# Altium schematic sheet Sheet2.SchDoc: Smart IoT Wallswitch CORE module
size A4; DrawnBy: Bc. Miroslav Kažimír; DocumentNumber: Power and USB connection; SheetNumber: 3; SheetTotal: 3
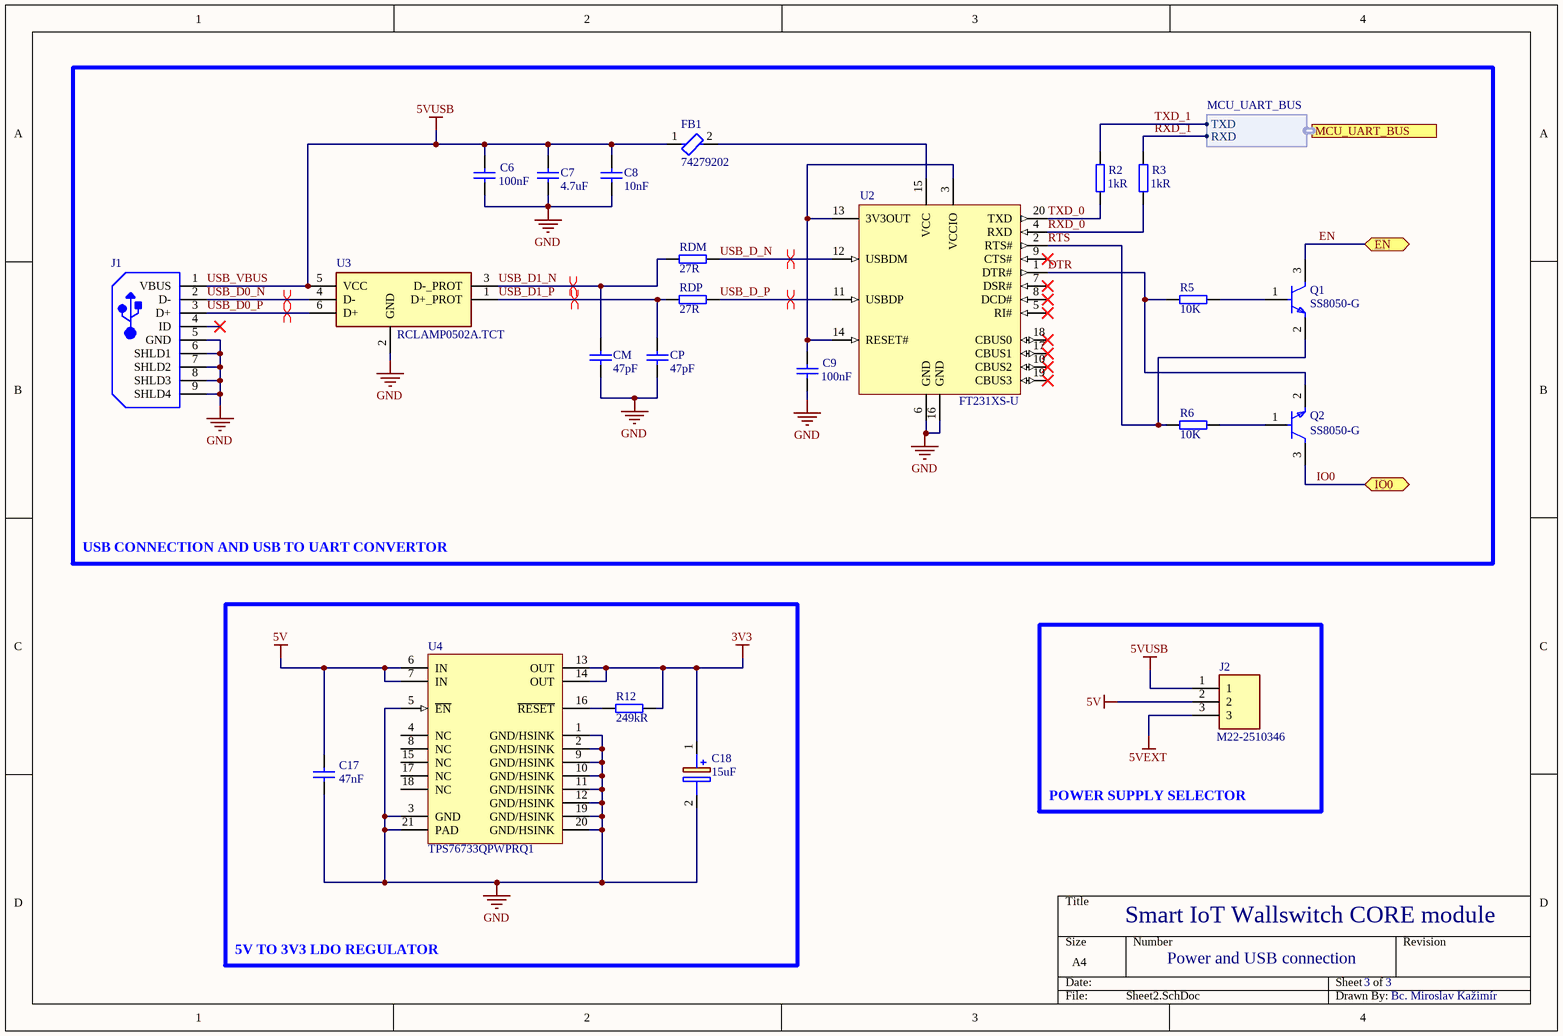
[diagram p0: Sheet2.SchDoc]

## Parts
C6  Capacitance: 100nF  [FP-C0805C-DN-IPC_A]  (hidden comment: C0805C104K5RAC7411)
C7  Capacitance: 4.7uF  [FP-GRM21B-0_15-IPC_A]  (hidden comment: GRM21BR71C475KE51L)
C8  Capacitance: 10nF  [FP-C0805C-DN-IPC_A]  (hidden comment: C0805C103J5RAC7025)
C9  Capacitance: 100nF  [FP-C0805C-DN-IPC_A]  (hidden comment: C0805C104K5RAC7411)
C17  Capacitance: 47nF  [FP-C0805C-DN-IPC_A]  (hidden comment: C0805C473K5RACAUTO)
C18  Capacitance: 15uF  [CAPPM3216X180N]  (hidden comment: T495A156K010ATE1K0)
CM  Capacitance: 47pF  [FP-C0805C-DN-IPC_A]  (hidden comment: C0805C470J5RACTU)
CP  Capacitance: 47pF  [FP-C0805C-DN-IPC_A]  (hidden comment: C0805C470J5RACTU)
FB1  74279202  [SMD-0805]
J1  10104110-0001LF  [101041100001LF]  (value not drawn)
J2  M22-2510346  [HDRV3W50P0X200_1X3_600X200X525P]
Q1  SS8050-G  [FP-SS8050-G-IPC_A]
Q2  SS8050-G  [FP-SS8050-G-IPC_A]
R2  Resistance: 1kR  [FP-ERJ3G-IPC_A]  (hidden comment: ERJ-3GEYJ102V)
R3  Resistance: 1kR  [FP-ERJ3G-IPC_A]  (hidden comment: ERJ-3GEYJ102V)
R5  Resistance: 10K  [RESC2012X70N]  (hidden comment: ERJ-UP6J103V)
R6  Resistance: 10K  [RESC2012X70N]  (hidden comment: ERJ-UP6J103V)
R12  Resistance: 249kR  [RESC2013X70X40NL20T20]  (hidden comment: ERJ-6ENF2493V)
RDM  Resistance: 27R  [RES_ERJP06F27R0V]  (hidden comment: ERJ-P06F27R0V)
RDP  Resistance: 27R  [RES_ERJP06F27R0V]  (hidden comment: ERJ-P06F27R0V)
U2  FT231XS-U  [SSOP-20_L]
U3  RCLAMP0502A.TCT  [SOTFL50P162X60-6N]
U4  TPS76733QPWPRQ1  [PWP0020L_L]

## Blocks framed on the sheet
USB CONNECTION AND USB TO UART CONVERTOR: C6-C9 CM CP FB1 J1 Q1 Q2 R2 R3 R5 R6 RDM RDP U2 U3
5V TO 3V3 LDO REGULATOR: C17 C18 R12 U4
POWER SUPPLY SELECTOR: J2

## Ports
EN (bidir), IO0 (bidir), MCU_UART_BUS (harness MCU_UART_BUS)

## Harnesses
MCU_UART_BUS: TXD, RXD

## Nets
3V3: C18.1(+) R12.1 U4.13(OUT) U4.14(OUT)
5V: C17.1 J2.2 U4.6(IN) U4.7(IN)
5VEXT: J2.3
GND: C6.2 C7.2 C8.2 C9.2 C17.2 C18.2(-) CM.2 CP.2 J1.5(GND) J1.6(SHLD1) J1.7(SHLD2) J1.8(SHLD3) J1.9(SHLD4) U2.6(GND) U2.16(GND) U3.2(GND) U4.1(GND/HSINK) U4.2(GND/HSINK) U4.3(GND) U4.5(~{EN}) U4.9(GND/HSINK) U4.10(GND/HSINK) U4.11(GND/HSINK) U4.12(GND/HSINK) U4.19(GND/HSINK) U4.20(GND/HSINK) U4.21(PAD)
USB_VBUS: C6.1 C7.1 C8.1 FB1.1 J1.1(VBUS) J2.1 U3.5(VCC)  [also labelled 5VUSB]
DTR: Q2.2(E) R5.1 U2.1(DTR#)
EN: Q1.3(C) ; port EN
IO0: Q2.3(C) ; port IO0
RTS: Q1.2(E) R6.1 U2.2(RTS#)
RXD_0: R3.2 U2.4(RXD)
RXD_1: R3.1 ; port MCU_UART_BUS.RXD
TXD_0: R2.2 U2.20(TXD)
TXD_1: R2.1 ; port MCU_UART_BUS.TXD
USB_D0_N: J1.2(D-) U3.4(D-)
USB_D0_P: J1.3(D+) U3.6(D+)
USB_D1_N: CM.1 RDM.1 U3.3(D-_PROT)
USB_D1_P: CP.1 RDP.1 U3.1(D+_PROT)
USB_D_N: RDM.2 U2.12(USBDM)
USB_D_P: RDP.2 U2.11(USBDP)
NetC9_1: C9.1 U2.3(VCCIO) U2.13(3V3OUT) U2.14(RESET#)
NetFB1_2: FB1.2 U2.15(VCC)
NetQ1_1: Q1.1(B) R5.2
NetQ2_1: Q2.1(B) R6.2
NetR12_2: R12.2 U4.16(~{RESET})

Not connected (* = marked no-connect by the designer): J1 4(ID)*; U2 5(RI#)* 7(DSR#)* 8(DCD#)* 9(CTS#)* 10(CBUS2)* 17(CBUS1)* 18(CBUS0)* 19(CBUS3)*; U4 4(NC) 8(NC) 15(NC) 17(NC) 18(NC)

## Layout directives
differential pair: USB_D0_N, USB_D0_P, USB_D1_N, USB_D1_P, USB_D_N, USB_D_P

## Library data of the parts
C6 C9 = C0805C104K5RAC7411: Cap Ceramic 0.1uF 50V X7R 10% SMD 0805 125°C Paper T/R; Manufacturer: KEMET; Supplier 1: Mouser; Manufacturer Part Number: C0805C104K5RAC7411; RoHS: Yes; Category: Ceramic Capacitors; Stock 1: 1484324; Pricing 1: 1=0,13000, 10=0,09300, 50=0,09300, 100=0,04400, 500=0,03100, 1000=0,02600, 2500=0,02400, 5000=0,02200, 10000=0,02100, 15000=0,02000 (USD); Mount: Surface Mount; Case/Package: 0805; Dielectric Material: Ceramic; Min Operating Temperature: -55°C; Max Operating Temperature: 125°C; Packaging: Tape and Reel; Tolerance: 10%; Dielectric: X7R; Voltage Rating (DC): 50V; Construction: Flat; Length: 2mm; Height: 0.9mm; Depth: 1.25mm; Radiation Hardening: No; RoHS Compliant: Yes; ComponentLink1URL: http://components.arrow.com/part/dataview/30748302S8994022N7429?src-supplier=Arrow+Electronics; ComponentLink1Description: http://components.arrow.com/part/dataview/30748302S8994022N7429?src-supplier=Arrow+Electronics; ComponentLink2URL: https://www.verical.com/server-webapp/html/getDatasheet?partID=248513&src-supplier=Verical; ComponentLink2Description: https://www.verical.com/server-webapp/html/getDatasheet?partID=248513&src-supplier=Verical; Supplier Part Number 1: 80-C0805C104K5RACLR
C7 = GRM21BR71C475KE51L: Cap Ceramic 4.7uF 16V X7R 10% SMD 0805 125°C Embossed Plastic T/R; Manufacturer: Murata; Supplier 1: Mouser; Manufacturer Part Number: GRM21BR71C475KE51L; RoHS: Yes; Category: Ceramic Capacitors; Stock 1: 388295; Pricing 1: 1=0,19000, 10=0,13400, 50=0,13400, 100=0,06400, 500=0,04500, 1000=0,03700, 3000=0,03500, 6000=0,03300, 10000=0,03300 (USD); Case/Package: 0805; Tolerance: 10%; Dielectric: X7R; Voltage Rating (DC): 16V; Length: 2mm; Width: 1.25mm; Thickness: 1.25mm; RoHS Compliant: Yes; ComponentLink1URL: http://www.farnell.com/datasheets/2189142.pdf?src-supplier=Farnell; ComponentLink1Description: http://www.farnell.com/datasheets/2189142.pdf?src-supplier=Farnell; ComponentLink2URL: http://search.murata.co.jp/Ceramy/image/img/A01X/G101/ENG/GRM21BR71C475KE51-01.pdf?src-supplier=Digi-Key; ComponentLink2Description: http://search.murata.co.jp/Ceramy/image/img/A01X/G101/ENG/GRM21BR71C475KE51-01.pdf?src-supplier=Digi-Key; Supplier Part Number 1: 81-GRM21BR71C475KE1L
C8 = C0805C103J5RAC7025: Cap Ceramic 0.01uF 50V X7R 5% SMD 0805 125°C Paper T/R; Manufacturer: KEMET; Supplier 1: Mouser; Manufacturer Part Number: C0805C103J5RAC7025; RoHS: Yes; Category: Ceramic Capacitors; Stock 1: 20879; Pricing 1: 1=0,12000, 10=0,07600, 50=0,07600, 100=0,03600, 1000=0,02300, 10000=0,01800 (USD); Mount: Surface Mount; Case/Package: 0805; Case Code (Imperial): 0805; Case Code (Metric): 2012; Dielectric Material: Ceramic; Min Operating Temperature: -55°C; Max Operating Temperature: 125°C; Tolerance: 5%; Dielectric: X7R; Packaging: Tape and Reel; Package Quantity: 4000; Voltage Rating: 50V; Voltage Rating (DC): 50V; Termination: SMD/SMT; Series: C0805C; Construction: Flat; Length: 2mm; Height: 0.78mm; Depth: 1.25mm; Lead Pitch: 0.75mm; Radiation Hardening: No; RoHS Compliant: Yes; ComponentLink1URL: http://www.mouser.com/ds/2/212/KEM_C1002_X7R_SMD-1102033.pdf?src-supplier=Mouser; ComponentLink1Description: http://www.mouser.com/ds/2/212/KEM_C1002_X7R_SMD-1102033.pdf?src-supplier=Mouser; Supplier Part Number 1: 80-C0805C103J5RACTM
C17 = C0805C473K5RACAUTO: KEMET   C0805C473K5RACAUTO   Multilayer Ceramic Capacitor, AEC-Q200 MLCC Series, 0.047 F,  10%, X7R, 50 V; Voltage Rating: 50V; Supplier 1: Mouser; Manufacturer: KEMET; Manufacturer Part Number: C0805C473K5RACAUTO; RoHS: Yes; Category: Ceramic Capacitors; Stock 1: 55914; Pricing 1: 1=0,19000, 10=0,07900, 50=0,07900, 100=0,06700, 500=0,04600, 1000=0,04100, 4000=0,03800, 8000=0,03700, 10000=0,03700, 12000=0,03600, 24000=0,03500 (USD); Mount: Surface Mount; Case/Package: 0805; Case Code (Metric): 2012; Case Code (Imperial): 0805; Contact Plating: Tin,Matte; Dielectric Material: Ceramic; Min Operating Temperature: -55°C; Max Operating Temperature: 125°C; Tolerance: 10%; Dielectric: X7R; Package Quantity: 1; Packaging: Tape and Reel; Voltage Rating (DC): 50V; Termination: SMD/SMT; Series: C; Construction: Flat; Length: 2mm; Width: 0.049inch; Height: 0.78mm; Depth: 1.25mm; Thickness: 0.035inch; Ratings: AEC-Q200; Radiation Hardening: No; REACH SVHC: No SVHC; RoHS Compliant: Yes; ComponentLink1URL: https://datasheet.ciiva.com/7842/1633156-7842358.pdf?src-supplier=Element14; ComponentLink1Description: https://datasheet.ciiva.com/7842/1633156-7842358.pdf?src-supplier=Element14; ComponentLink2URL: https://datasheet.ciiva.com/22704/1633156-22704879.pdf?src-supplier=Element14; ComponentLink2Description: https://datasheet.ciiva.com/22704/1633156-22704879.pdf?src-supplier=Element14; Supplier Part Number 1: 80-C0805C473K5RAUTO
C18 = T495A156K010ATE1K0: Cap Tant Solid 15uF 10V A CASE 10% (3.2 X 1.6 X 1.6mm) Inward L SMD 3216-18 1 Ohm 125C Automotive T/R; Manufacturer: KEMET; ESR (Equivalent Series Resistance): 1R; Life (Hours): 2000Hour; Supplier 1: Mouser; Manufacturer Part Number: T495A156K010ATE1K0; RoHS: Yes; Category: Tantalum Capacitors; Stock 1: 278; Pricing 1: 1=0,73000, 10=0,59100, 50=0,44700, 100=0,38900, 1000=0,30900, 10000=0,28100 (USD); Mount: Surface Mount; Case/Package: 1206; Case Code (Metric): 3216; Case Code (Imperial): 1206; Min Operating Temperature: -55°C; Max Operating Temperature: 125°C; Package Quantity: 2000; Packaging: Tape and Reel; Tolerance: 10%; Voltage Rating: 10V; Features: General Purpose; Length: 0.126inch; Width: 0.063inch; Height - Seated (Max): 0.071inch; RoHS Compliant: Yes; ComponentLink1URL: http://www.kemet.com/docfinder?Partnumber=T495A156K010ATE1K0&src-supplier=Digi-Key; ComponentLink1Description: http://www.kemet.com/docfinder?Partnumber=T495A156K010ATE1K0&src-supplier=Digi-Key; ComponentLink2URL: https://api.kemet.com/component-edge/download/datasheet/T495A156K010ATE1K0.pdf?src-supplier=Digi-Key; ComponentLink2Description: https://api.kemet.com/component-edge/download/datasheet/T495A156K010ATE1K0.pdf?src-supplier=Digi-Key; Supplier Part Number 1: 80-T495A156K10ATE1K0
CM CP = C0805C470J5RACTU: 47.0Pf 50.0V Rohs Compliant: Yes; Manufacturer: KEMET; Supplier 1: Mouser; Manufacturer Part Number: C0805C470J5RACTU; RoHS: Yes; Category: Ceramic Capacitors; Stock 1: 9354; Pricing 1: 1=0,28000, 10=0,19800, 50=0,19800, 100=0,11200, 1000=0,06900, 10000=0,06000 (USD); RoHS Compliant: Yes; Supplier Part Number 1: 80-C0805C470J5RACTU
FB1 = 74279202: Ferrite SMD Construction form: 0805 DC resistance: 0.1 Ohm Impedance @ 100 MHz: 120 Ohm; Manufacturer: Wurth Electronics; Tolerance: 25%; Impedance: 120R; Max Current Rating: 500mA; DC Resistance (DCR): 100mR; Test Frequency: 100MHz; Number of Lines: 1; Supplier 1: Mouser; Manufacturer Part Number: 74279202; RoHS: Yes; Category: Ferrite Beads and Chips; Mount: Surface Mount; Case/Package: SMD/SMT; Case Code (Metric): 2012; Case Code (Imperial): 0805; Weight: 0.000388oz; Min Operating Temperature: -55°C; Max Operating Temperature: 125°C; Package Quantity: 1; Packaging: Tape and Reel; Max DC Current: 500mA; Termination: SMD/SMT; Series: WE-CBF; Current Rating: 500mA; Resistance: 100mR; Length: 2mm; Width: 1.2mm; Height: 0.9mm; Depth: 1.24mm; REACH SVHC: Unknown; RoHS Compliant: Yes; Lead Free: Lead Free; ComponentLink1URL: https://datasheet.ciiva.com/1126/1696029-1126528.pdf?src-supplier=Element14; ComponentLink1Description: https://datasheet.ciiva.com/1126/1696029-1126528.pdf?src-supplier=Element14; ComponentLink2URL: https://datasheet.ciiva.com/11795/0900766b80bbd134-11795958.pdf?src-supplier=RSComponents; ComponentLink2Description: https://datasheet.ciiva.com/11795/0900766b80bbd134-11795958.pdf?src-supplier=RSComponents; ComponentLink3URL: https://datasheet.ciiva.com/4940/74279202-50314-4940485.pdf?src-supplier=Mouser; ComponentLink3Description: https://datasheet.ciiva.com/4940/74279202-50314-4940485.pdf?src-supplier=Mouser; ComponentLink4URL: https://datasheet.ciiva.com/6212/74279202-6212647.pdf?src-supplier=Digi-Key; ComponentLink4Description: https://datasheet.ciiva.com/6212/74279202-6212647.pdf?src-supplier=Digi-Key; ComponentLink5URL: https://datasheet.ciiva.com/22711/1696029-22711339.pdf?src-supplier=Element14; ComponentLink5Description: https://datasheet.ciiva.com/22711/1696029-22711339.pdf?src-supplier=Element14; ComponentLink6URL: https://datasheet.ciiva.com/6212/74279202-6212651.pdf?src-supplier=Digi-Key; ComponentLink6Description: https://datasheet.ciiva.com/6212/74279202-6212651.pdf?src-supplier=Digi-Key; ComponentLink7URL: https://datasheet.ciiva.com/6212/74279202-6212654.pdf?src-supplier=Digi-Key; ComponentLink7Description: https://datasheet.ciiva.com/6212/74279202-6212654.pdf?src-supplier=Digi-Key; Supplier Part Number 1: 710-74279202
J1 = 10104110-0001LF: Conn Micro USB 2.0 Type B RCP 5 POS 0.65mm Solder RA SMD 5 Terminal 1 Port T/R; Manufacturer: Amphenol ICC / FCI; Supplier 1: Mouser; Manufacturer Part Number: 10104110-0001LF; RoHS: No; Category: USB Connectors; Stock 1: 23329; Pricing 1: 1=0,83000, 10=0,65600, 50=0,65600, 100=0,57100, 1000=0,45600, 10000=0,40800 (USD); ComponentLink1URL: https://datasheet.ciiva.com/11731/0900766b80ed1ae6-11731334.pdf?src-supplier=RSComponents; ComponentLink1Description: https://datasheet.ciiva.com/11731/0900766b80ed1ae6-11731334.pdf?src-supplier=RSComponents; ComponentLink2URL: https://datasheet.ciiva.com/5726/10104110-5726973.pdf?src-supplier=Farnell; ComponentLink2Description: https://datasheet.ciiva.com/5726/10104110-5726973.pdf?src-supplier=Farnell; Supplier Part Number 1: 649-10104110-0001LF
J2 = M22-2510346: 2.00mm (0.079") Pitch SIL Vertical 2.4mm PC Tail Pin Header, 3.5mm mating pin height, tin, 3 contacts; Manufacturer: Harwin; Number of Contacts: 3; Max Current Rating: 1A; Contact Resistance: 30mR; Voltage Rating: 650V; Gender: Male; Connector Type: Male Pin; Pitch: 2mm; Supplier 1: Mouser; Manufacturer Part Number: M22-2510346; RoHS: Yes; Category: Headers and Wire Housings; Stock 1: 3158; Pricing 1: 1=0,24000, 10=0,18300, 50=0,18300, 100=0,14900, 1000=0,10900, 10000=0,08800 (USD); Mount: Through Hole; Case/Package: SIL; Contact Plating: Tin; Contact Material: Bronze; Color: Black; Housing Color: Black; Housing Material: Nylon; Min Operating Temperature: -55°C; Max Operating Temperature: 105°C; Number of Rows: 1; Termination: Solder; Current Rating: 1A; Package Quantity: 1000; Packaging: Bulk; Number of Positions: 3; Orientation: Straight; Series: M22; Contact Type: Male Pin; Length: 6mm; Contact Mating Length: 0.138inch; Depth: 2mm; RoHS Compliant: Yes; ComponentLink1URL: http://www.mouser.com/ds/2/181/M22-251-1134335.pdf?src-supplier=Mouser; ComponentLink1Description: http://www.mouser.com/ds/2/181/M22-251-1134335.pdf?src-supplier=Mouser; ComponentLink2URL: http://cdn.harwin.com/pdfs/M22-251.pdf?src-supplier=Digi-Key; ComponentLink2Description: http://cdn.harwin.com/pdfs/M22-251.pdf?src-supplier=Digi-Key; ComponentLink3URL: http://www.harwin.com/include/downloads/pdfs/2010PAGE109.PDF?src-supplier=Avnet; ComponentLink3Description: http://www.harwin.com/include/downloads/pdfs/2010PAGE109.PDF?src-supplier=Avnet; ComponentLink4URL: https://cdn.harwin.com/pdfs/M22-251.pdf?src-supplier=Digi-Key; ComponentLink4Description: https://cdn.harwin.com/pdfs/M22-251.pdf?src-supplier=Digi-Key; Supplier Part Number 1: 855-M22-2510346
Q1 Q2 = SS8050-G: Trans Gp Bjt NPN 25V 1.5A 300MW 3-PIN SOT-23 T/r; Manufacturer: Comchip; Collector Emitter Voltage (VCEO): 400mV; Transition Frequency: 100MHz; Supplier 1: Mouser; Manufacturer Part Number: SS8050-G; RoHS: Yes; Stock 1: 22728; Pricing 1: 1=0,31000, 10=0,20400, 50=0,20400, 100=0,09200, 1000=0,05800, 3000=0,04400, 9000=0,03700, 10000=0,03700, 24000=0,03500, 45000=0,03300, 99000=0,02800 (USD); Mount: Surface Mount; Case/Package: TO-236-3; Packaging: Tape and Reel; Max Collector Current: 1.5A; Max Power Dissipation: 300mW; Collector Emitter Breakdown Voltage: 25V; Max Breakdown Voltage: 25V; ComponentLink1URL: http://www.comchiptech.com/admin/files/product/SS8050-G RevA181526.pdf?src-supplier=Digi-Key; ComponentLink1Description: http://www.comchiptech.com/admin/files/product/SS8050-G RevA181526.pdf?src-supplier=Digi-Key; ComponentLink2URL: http://www.comchiptech.com/cms/UserFiles/SS8050-G%20RevA181526.pdf?src-supplier=Digi-Key; ComponentLink2Description: http://www.comchiptech.com/cms/UserFiles/SS8050-G%20RevA181526.pdf?src-supplier=Digi-Key; Supplier Part Number 1: 750-SS8050-G
R2 R3 = ERJ-3GEYJ102V: RES SMD 1K OHM 5% 1/10W 0603; Manufacturer: Panasonic; Temperature Coefficient: 200ppm/°C; Power Rating: 100mW; Voltage Rating: 75V; Voltage Rating (DC): 50V; Supplier 1: Mouser; Manufacturer Part Number: ERJ-3GEYJ102V; RoHS: Yes; Category: Chip SMD Resistors; Stock 1: 2053319; Pricing 1: 1=0,10000, 10=0,04400, 50=0,04400, 100=0,01800, 1000=0,00800, 2500=0,00700, 5000=0,00500, 10000=0,00500 (USD); Mount: Surface Mount; Case/Package: 0603; Weight: 7.1E-05oz; Contact Plating: Tin; Case Code (Metric): 1608; Case Code (Imperial): 0603; Min Operating Temperature: -55°C; Max Operating Temperature: 155°C; Tolerance: 5%; Resistor Type: Thick Film; Packaging: Tape and Reel; Package Quantity: 1; Termination: SMD/SMT; Max Power Dissipation: 100mW; Number of Terminations: 2; Working Voltage: 75V; Features: Automotive AEC-Q200; Series: ERJ; Technology: THICK FILM; Construction: Rectangular; Resistance Tolerance: 5%; Length: 1.6mm; Width: 0.031inch; Height: 0.45mm; Depth: 0.8mm; Radiation Hardening: No; REACH SVHC: No SVHC; Military Standard: Not; Lead Free: Lead Free; RoHS Compliant: Yes; ComponentLink1URL: https://datasheet.ciiva.com/34303/1988487-34303608.pdf?src-supplier=Jameco; ComponentLink1Description: https://datasheet.ciiva.com/34303/1988487-34303608.pdf?src-supplier=Jameco; ComponentLink2URL: https://datasheet.ciiva.com/11808/0900766b80f806dd-11808320.pdf?src-supplier=RSComponents; ComponentLink2Description: https://datasheet.ciiva.com/11808/0900766b80f806dd-11808320.pdf?src-supplier=RSComponents; ComponentLink3URL: https://datasheet.ciiva.com/43460/1678796-43460714.pdf?src-supplier=Farnell; ComponentLink3Description: https://datasheet.ciiva.com/43460/1678796-43460714.pdf?src-supplier=Farnell; ComponentLink4URL: https://datasheet.ciiva.com/46386/1678796-46386459.pdf?src-supplier=Element14; ComponentLink4Description: https://datasheet.ciiva.com/46386/1678796-46386459.pdf?src-supplier=Element14; ComponentLink5URL: https://datasheet.ciiva.com/22783/1678796-22783822.pdf?src-supplier=Farnell; ComponentLink5Description: https://datasheet.ciiva.com/22783/1678796-22783822.pdf?src-supplier=Farnell; ComponentLink6URL: https://datasheet.ciiva.com/46371/1678796-46371934.pdf?src-supplier=Element14; ComponentLink6Description: https://datasheet.ciiva.com/46371/1678796-46371934.pdf?src-supplier=Element14; ComponentLink7URL: https://datasheet.ciiva.com/28532/1678796-28532126.pdf?src-supplier=Element14; ComponentLink7Description: https://datasheet.ciiva.com/28532/1678796-28532126.pdf?src-supplier=Element14; ComponentLink8URL: https://datasheet.ciiva.com/46451/1678796-46451226.pdf?src-supplier=Element14; ComponentLink8Description: https://datasheet.ciiva.com/46451/1678796-46451226.pdf?src-supplier=Element14; ComponentLink9URL: https://datasheet.ciiva.com/24159/aoa0000ce1-37422-24159481.pdf?src-supplier=Mouser; ComponentLink9Description: https://datasheet.ciiva.com/24159/aoa0000ce1-37422-24159481.pdf?src-supplier=Mouser; ComponentLink10URL: https://datasheet.ciiva.com/16787/70255313-16787626.pdf?src-supplier=Allied+Electronics; ComponentLink10Description: https://datasheet.ciiva.com/16787/70255313-16787626.pdf?src-supplier=Allied+Electronics; ComponentLink11URL: https://datasheet.ciiva.com/9117/aoa0000ce1-9117035.pdf?src-supplier=Avnet; ComponentLink11Description: https://datasheet.ciiva.com/9117/aoa0000ce1-9117035.pdf?src-supplier=Avnet; ComponentLink12URL: https://datasheet.ciiva.com/16740/aoa0000ce1-16740759.pdf?src-supplier=Future+Electronics; ComponentLink12Description: https://datasheet.ciiva.com/16740/aoa0000ce1-16740759.pdf?src-supplier=Future+Electronics; ComponentLink13URL: https://datasheet.ciiva.com/48532/aoa0000ce1-48532155.pdf?src-supplier=Avnet; ComponentLink13Description: https://datasheet.ciiva.com/48532/aoa0000ce1-48532155.pdf?src-supplier=Avnet; ComponentLink14URL: https://datasheet.ciiva.com/30224/4aoa0000ce1-30224167.pdf?src-supplier=Onlinecomponents.com; ComponentLink14Description: https://datasheet.ciiva.com/30224/4aoa0000ce1-30224167.pdf?src-supplier=Onlinecomponents.com; Supplier Part Number 1: 667-ERJ-3GEYJ102V
R5 R6 = ERJ-UP6J103V: Res 10K Ohm 5% 1/2W 0805; Manufacturer: Panasonic; Supplier 1: Mouser; Manufacturer Part Number: ERJ-UP6J103V; RoHS: No; Category: Chip SMD Resistors; Stock 1: 46150; Pricing 1: 1=0,16000, 10=0,11900, 50=0,11900, 100=0,05800, 1000=0,02500, 10000=0,02100 (USD); Supplier Part Number 1: 667-ERJ-UP6J103V
R12 = ERJ-6ENF2493V: Res Thick Film 0805 249K Ohm 1% 1/8W ±100ppm/°C Molded SMD Punched Carrier T/R; Manufacturer: Panasonic; Voltage Rating: 150V; Power Rating: 125mW; Supplier 1: Mouser; Manufacturer Part Number: ERJ-6ENF2493V; RoHS: Yes; Category: Chip SMD Resistors; Stock 1: 22124; Pricing 1: 1=0,11000, 10=0,08300, 50=0,08300, 100=0,03200, 1000=0,01400, 10000=0,01000 (USD); Mount: Surface Mount; Case/Package: 0805; Contact Plating: Tin; Case Code (Imperial): 0805; Case Code (Metric): 2012; Min Operating Temperature: -55°C; Max Operating Temperature: 155°C; Tolerance: 1%; Resistor Type: Thick Film; Temperature Coefficient: 100ppm/°C; Packaging: Tape and Reel; Package Quantity: 5000; Number of Terminations: 2; Termination: SMD/SMT; Max Power Dissipation: 125mW; Voltage Rating (DC): 150V; Series: ERJ; Resistance Tolerance: 1%; Construction: Rectangular; Technology: THICK FILM; Length: 2mm; Width: 1.2mm; Height: 0.6mm; Depth: 1.25mm; Radiation Hardening: No; REACH SVHC: Unknown; Military Standard: Not; Lead Free: Lead Free; RoHS Compliant: Yes; ComponentLink1URL: https://datasheet.ciiva.com/11821/0900766b80f80784-11821592.pdf?src-supplier=RSComponents; ComponentLink1Description: https://datasheet.ciiva.com/11821/0900766b80f80784-11821592.pdf?src-supplier=RSComponents; ComponentLink2URL: https://datasheet.ciiva.com/16770/70260748-16770245.pdf?src-supplier=Allied+Electronics; ComponentLink2Description: https://datasheet.ciiva.com/16770/70260748-16770245.pdf?src-supplier=Allied+Electronics; ComponentLink3URL: https://datasheet.ciiva.com/30160/aoa0000ce2-30160949.pdf?src-supplier=Onlinecomponents.com; ComponentLink3Description: https://datasheet.ciiva.com/30160/aoa0000ce2-30160949.pdf?src-supplier=Onlinecomponents.com; ComponentLink4URL: https://datasheet.ciiva.com/43460/426256-43460070.pdf?src-supplier=Farnell; ComponentLink4Description: https://datasheet.ciiva.com/43460/426256-43460070.pdf?src-supplier=Farnell; ComponentLink5URL: https://datasheet.ciiva.com/9183/aoa0000ce2-9183882.pdf?src-supplier=Avnet; ComponentLink5Description: https://datasheet.ciiva.com/9183/aoa0000ce2-9183882.pdf?src-supplier=Avnet; ComponentLink6URL: https://datasheet.ciiva.com/46377/426256-46377786.pdf?src-supplier=Element14; ComponentLink6Description: https://datasheet.ciiva.com/46377/426256-46377786.pdf?src-supplier=Element14; ComponentLink7URL: https://datasheet.ciiva.com/28692/1678782-28692523.pdf?src-supplier=Element14; ComponentLink7Description: https://datasheet.ciiva.com/28692/1678782-28692523.pdf?src-supplier=Element14; ComponentLink8URL: https://datasheet.ciiva.com/28594/1678782-28594733.pdf?src-supplier=Element14; ComponentLink8Description: https://datasheet.ciiva.com/28594/1678782-28594733.pdf?src-supplier=Element14; ComponentLink9URL: https://datasheet.ciiva.com/29927/aoa0000ce2-29927535.pdf?src-supplier=Avnet; ComponentLink9Description: https://datasheet.ciiva.com/29927/aoa0000ce2-29927535.pdf?src-supplier=Avnet; Supplier Part Number 1: 667-ERJ-6ENF2493V
RDM RDP = ERJ-P06F27R0V: Res Thick Film 0805 27 Ohm 1% 0.25W ±300ppm/°C Molded SMD Punched Carrier T/R; Manufacturer: Panasonic; Power Rating: 500mW; Voltage Rating: 150V; Supplier 1: Mouser; Manufacturer Part Number: ERJ-P06F27R0V; RoHS: Yes; Category: Chip SMD Resistors; Stock 1: 25086; Pricing 1: 1=0,20000, 10=0,16900, 50=0,16900, 100=0,06700, 1000=0,02800, 10000=0,02300 (USD); Mount: Surface Mount; Case/Package: 0805; Number of Pins: 2; Contact Plating: Tin; Case Code (Imperial): 0805; Case Code (Metric): 2012; Weight: 0.000194oz; Min Operating Temperature: -55°C; Max Operating Temperature: 155°C; Tolerance: 1%; Resistor Type: Thick Film; Temperature Coefficient: 300ppm/°C; Packaging: Tape and Reel; Termination: SMD/SMT; Voltage Rating (DC): 150V; Length: 2mm; Width: 1.2mm; Height: 0.6mm; Depth: 1.25mm; Radiation Hardening: No; REACH SVHC: No SVHC; Military Standard: Not; RoHS Compliant: Yes; ComponentLink1URL: https://datasheet.ciiva.com/11810/0900766b812cb812-11810836.pdf?src-supplier=RSComponents; ComponentLink1Description: https://datasheet.ciiva.com/11810/0900766b812cb812-11810836.pdf?src-supplier=RSComponents; ComponentLink2URL: https://datasheet.ciiva.com/48426/erjp-series-eng-tds-48426807.pdf?src-supplier=Distrelec; ComponentLink2Description: https://datasheet.ciiva.com/48426/erjp-series-eng-tds-48426807.pdf?src-supplier=Distrelec; ComponentLink3URL: https://datasheet.ciiva.com/5915/1801181-5915438.pdf?src-supplier=Farnell; ComponentLink3Description: https://datasheet.ciiva.com/5915/1801181-5915438.pdf?src-supplier=Farnell; ComponentLink4URL: https://datasheet.ciiva.com/7891/1801181-7891423.pdf?src-supplier=Element14; ComponentLink4Description: https://datasheet.ciiva.com/7891/1801181-7891423.pdf?src-supplier=Element14; ComponentLink5URL: https://datasheet.ciiva.com/5915/1801181-5915437.pdf?src-supplier=Farnell; ComponentLink5Description: https://datasheet.ciiva.com/5915/1801181-5915437.pdf?src-supplier=Farnell; ComponentLink6URL: https://datasheet.ciiva.com/24125/aoa0000ce4-64075-24125050.pdf?src-supplier=Mouser; ComponentLink6Description: https://datasheet.ciiva.com/24125/aoa0000ce4-64075-24125050.pdf?src-supplier=Mouser; ComponentLink7URL: https://datasheet.ciiva.com/9297/aoa0000ce4-9297918.pdf?src-supplier=Avnet; ComponentLink7Description: https://datasheet.ciiva.com/9297/aoa0000ce4-9297918.pdf?src-supplier=Avnet; Supplier Part Number 1: 667-ERJ-P06F27R0V
U2 = FT231XS-U: FT231XS-U, Usb Controller, 3MBD, Usb 1.1, Usb 2.0, 5 V, 20-PIN SSOP; Manufacturer: FTDI; Number of Channels: 1; Operating Supply Voltage: 5V; Max Supply Voltage: 5.5V; Min Supply Voltage: 2.97V; Data Rate: 3Mbps; ESD Protection: Yes; Supplier 1: Mouser; Manufacturer Part Number: FT231XS-U; RoHS: Yes; Category: Interface ICs; Stock 1: 294; Pricing 1: 1=2,34000, 10=2,34000, 25=2,27000, 50=2,27000, 100=2,27000, 116=2,20000, 1000=1,82000, 10000=1,75000 (USD); Mount: Surface Mount; Case/Package: SSOP; Number of Pins: 20; Min Operating Temperature: -40°C; Max Operating Temperature: 85°C; Packaging: Rail/Tube; Package Quantity: 58; Number of Transceivers: 1; Series: *; Length: 8.74mm; Width: 3.99mm; Height: 1.5mm; Radiation Hardening: No; Lead Free: Lead Free; RoHS Compliant: Yes; ComponentLink1URL: https://datasheet.ciiva.com/48909/70403933-48909079.pdf?src-supplier=Allied+Electronics; ComponentLink1Description: https://datasheet.ciiva.com/48909/70403933-48909079.pdf?src-supplier=Allied+Electronics; ComponentLink2URL: https://datasheet.ciiva.com/15150/getdatasheetpartid-643513-15150507.pdf?src-supplier=Verical; ComponentLink2Description: https://datasheet.ciiva.com/15150/getdatasheetpartid-643513-15150507.pdf?src-supplier=Verical; ComponentLink3URL: https://datasheet.ciiva.com/16379/ds-ft231x-16379279.pdf?src-supplier=Future+Electronics; ComponentLink3Description: https://datasheet.ciiva.com/16379/ds-ft231x-16379279.pdf?src-supplier=Future+Electronics; Supplier Part Number 1: 895-FT231XS-U
U3 = RCLAMP0502A.TCT: TVS二极管 5V IPPM=3A 50W 单向; Manufacturer: Semtech; Direction: Unidirectional; Capacitance: 0.9pF; Number of Channels: 2; Reverse Breakdown Voltage: 6V; Number of Elements: 1; Clamping Voltage: 18V; Power Line Protection: Yes; Peak Pulse Current: 3A; Test Current: 1mA; Max Reverse Leakage Current: 1uA; Element Configuration: Single; Supplier 1: Mouser; Manufacturer Part Number: RCLAMP0502A.TCT; RoHS: Yes; Category: TVS Diodes; Stock 1: 213169; Pricing 1: 1=0,91000, 10=0,79900, 50=0,79900, 100=0,61300, 1000=0,38800, 10000=0,35000 (USD); Mount: Surface Mount; Case/Package: SC; Number of Pins: 6; Min Operating Temperature: -55°C; Max Operating Temperature: 125°C; Packaging: Tape and Reel; Number of Bidirectional Channels: 2; Reverse Standoff Voltage: 5V; Min Breakdown Voltage: 6V; Peak Pulse Power: 50W; Polarity: Unidirectional; Max Breakdown Voltage: 6V; ESD Protection: Yes; Max Power Dissipation: 50W; Leakage Current: 1uA; Current: 3A; Voltage: 5V; Series: RailClamp®; Clamping Voltage-Max: 18V; Length: 1.6mm; Width: 1.2mm; Height: 0.6mm; Radiation Hardening: No; Lead Free: Lead Free; RoHS Compliant: Yes; ComponentLink1URL: https://datasheet.ciiva.com/17052/0900766b80d896e8-17052765.pdf?src-supplier=Allied+Electronics; ComponentLink1Description: https://datasheet.ciiva.com/17052/0900766b80d896e8-17052765.pdf?src-supplier=Allied+Electronics; ComponentLink2URL: https://datasheet.ciiva.com/16208/rclamp0502a-16208898.pdf?src-supplier=Future+Electronics; ComponentLink2Description: https://datasheet.ciiva.com/16208/rclamp0502a-16208898.pdf?src-supplier=Future+Electronics; ComponentLink3URL: https://datasheet.ciiva.com/18065/getdatasheetpartid-185280-18065939.pdf?src-supplier=Verical; ComponentLink3Description: https://datasheet.ciiva.com/18065/getdatasheetpartid-185280-18065939.pdf?src-supplier=Verical; ComponentLink4URL: https://datasheet.ciiva.com/338/rclamp0502a-338509.pdf?src-supplier=Digi-Key; ComponentLink4Description: https://datasheet.ciiva.com/338/rclamp0502a-338509.pdf?src-supplier=Digi-Key; ComponentLink5URL: https://datasheet.ciiva.com/338/rclamp0502a-338510.pdf?src-supplier=Digi-Key; ComponentLink5Description: https://datasheet.ciiva.com/338/rclamp0502a-338510.pdf?src-supplier=Digi-Key; ComponentLink6URL: https://datasheet.ciiva.com/338/rclamp0502a-338508.pdf?src-supplier=Digi-Key; ComponentLink6Description: https://datasheet.ciiva.com/338/rclamp0502a-338508.pdf?src-supplier=Digi-Key; Supplier Part Number 1: 947-RCLAMP0502A.TCT
U4 = TPS76733QPWPRQ1: Automotive 1-A, 10-V, low-dropout voltage regulator with enable 20-HTSSOP -40 to 125; Manufacturer: Texas Instruments; Max Power Dissipation: 7.2W; Dropout Voltage: 350mV; Output Current: 1A; Output Voltage: 3.3V; Number of Outputs: 1; Max Input Voltage: 10V; Min Input Voltage: 2.7V; Input Bias Current: 85uA; Polarity: Positive; Quiescent Current: 80uA; Accuracy: 2%; Output Type: Fixed; Supplier 1: Mouser; Manufacturer Part Number: TPS76733QPWPRQ1; RoHS: Yes; Category: Voltage Regulators - Linear; Stock 1: 472; Pricing 1: 1=5,02000, 10=4,51000, 50=4,26000, 100=3,70000, 1000=2,75000, 10000=2,75000 (USD); Case/Package: HTSSOP; Number of Pins: 20; Min Operating Temperature: -40°C; Max Operating Temperature: 125°C; Packaging: Tape and Reel; Package Quantity: 1; Max Output Current: 1A; Number of Regulators: 1; Power Dissipation: 7.2W; Min Output Voltage: 3.3V; Output Voltage Accuracy: 2%; Max Output Voltage: 3.3V; Series: Automotive, AEC-Q100; Radiation Hardening: No; REACH SVHC: Unknown; Lead Free: Lead Free; RoHS Compliant: Yes; ComponentLink1URL: https://datasheet.ciiva.com/2046/tps76715-q1-2046224.pdf?src-supplier=Digi-Key; ComponentLink1Description: https://datasheet.ciiva.com/2046/tps76715-q1-2046224.pdf?src-supplier=Digi-Key; ComponentLink2URL: https://datasheet.ciiva.com/14275/tps76733-q1-14275667.pdf?src-supplier=Avnet; ComponentLink2Description: https://datasheet.ciiva.com/14275/tps76733-q1-14275667.pdf?src-supplier=Avnet; ComponentLink3URL: https://datasheet.ciiva.com/2046/tps76715-q1-2046223.pdf?src-supplier=Digi-Key; ComponentLink3Description: https://datasheet.ciiva.com/2046/tps76715-q1-2046223.pdf?src-supplier=Digi-Key; ComponentLink4URL: https://datasheet.ciiva.com/2046/tps76715-q1-2046222.pdf?src-supplier=Digi-Key; ComponentLink4Description: https://datasheet.ciiva.com/2046/tps76715-q1-2046222.pdf?src-supplier=Digi-Key; Supplier Part Number 1: 595-TPS76733QPWPRQ1